# Altium schematic sheet FPGA - Copy.SchDoc
size A3; DocumentNumber: 6; SheetNumber: 6; SheetTotal: 8
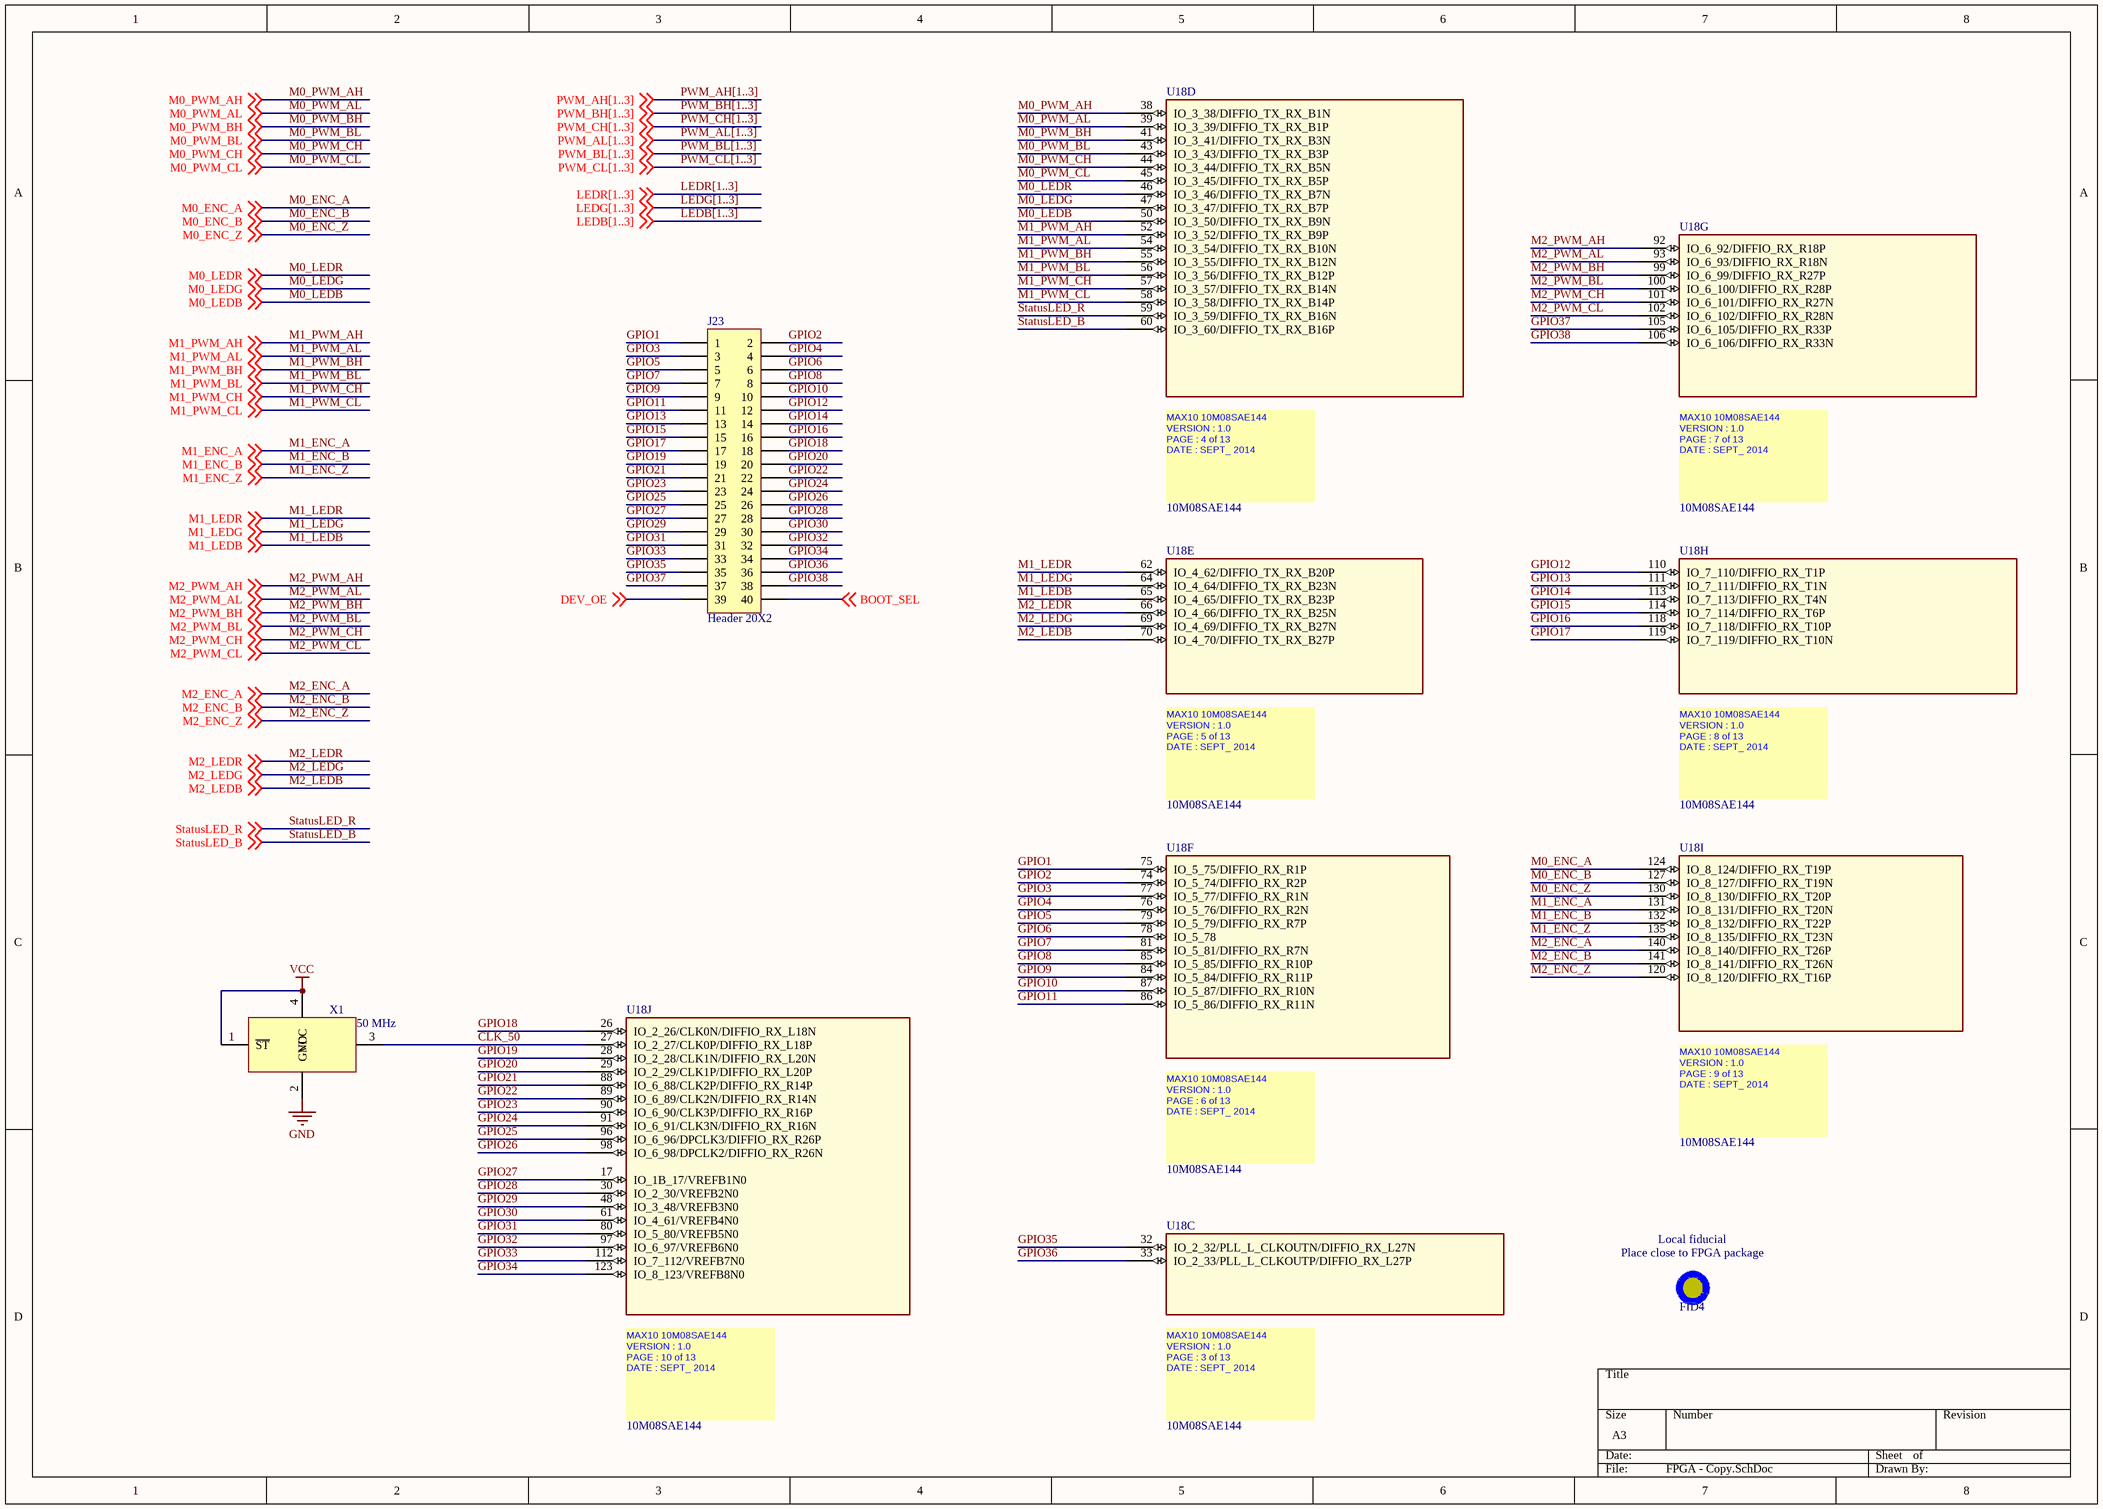
[diagram p0: FPGA - Copy.SchDoc]

## Parts
FID4  FIDUCIAL  [FIDUCIAL]  (value not drawn)
J23  Header 20X2  [HDR2X20]
U18  10M08SAE144  [SQFP50P2200X2200X165_HS-145N]  (parts C,D,E,F,G,H,I,J of 13)
X1  value 50 MHz  [SPXO SG-210STF]  (hidden comment: X1G0041710047)

## Nets
GND: X1.2(GND)
VCC: X1.1(~{ST}) X1.4(VCC)
BOOT_SEL: J23.40 ; off-sheet BOOT_SEL
CLK_50: U18.27(IO_2_27/CLK0P/DIFFIO_RX_L18P) X1.3(CLKout)
DEV_OE: J23.39 ; off-sheet DEV_OE
GPIO1: J23.1 U18.75(IO_5_75/DIFFIO_RX_R1P)
GPIO2: J23.2 U18.74(IO_5_74/DIFFIO_RX_R2P)
GPIO3: J23.3 U18.77(IO_5_77/DIFFIO_RX_R1N)
GPIO4: J23.4 U18.76(IO_5_76/DIFFIO_RX_R2N)
GPIO5: J23.5 U18.79(IO_5_79/DIFFIO_RX_R7P)
GPIO6: J23.6 U18.78(IO_5_78)
GPIO7: J23.7 U18.81(IO_5_81/DIFFIO_RX_R7N)
GPIO8: J23.8 U18.85(IO_5_85/DIFFIO_RX_R10P)
GPIO9: J23.9 U18.84(IO_5_84/DIFFIO_RX_R11P)
GPIO10: J23.10 U18.87(IO_5_87/DIFFIO_RX_R10N)
GPIO11: J23.11 U18.86(IO_5_86/DIFFIO_RX_R11N)
GPIO12: J23.12 U18.110(IO_7_110/DIFFIO_RX_T1P)
GPIO13: J23.13 U18.111(IO_7_111/DIFFIO_RX_T1N)
GPIO14: J23.14 U18.113(IO_7_113/DIFFIO_RX_T4N)
GPIO15: J23.15 U18.114(IO_7_114/DIFFIO_RX_T6P)
GPIO16: J23.16 U18.118(IO_7_118/DIFFIO_RX_T10P)
GPIO17: J23.17 U18.119(IO_7_119/DIFFIO_RX_T10N)
GPIO18: J23.18 U18.26(IO_2_26/CLK0N/DIFFIO_RX_L18N)
GPIO19: J23.19 U18.28(IO_2_28/CLK1N/DIFFIO_RX_L20N)
GPIO20: J23.20 U18.29(IO_2_29/CLK1P/DIFFIO_RX_L20P)
GPIO21: J23.21 U18.88(IO_6_88/CLK2P/DIFFIO_RX_R14P)
GPIO22: J23.22 U18.89(IO_6_89/CLK2N/DIFFIO_RX_R14N)
GPIO23: J23.23 U18.90(IO_6_90/CLK3P/DIFFIO_RX_R16P)
GPIO24: J23.24 U18.91(IO_6_91/CLK3N/DIFFIO_RX_R16N)
GPIO25: J23.25 U18.96(IO_6_96/DPCLK3/DIFFIO_RX_R26P)
GPIO26: J23.26 U18.98(IO_6_98/DPCLK2/DIFFIO_RX_R26N)
GPIO27: J23.27 U18.17(IO_1B_17/VREFB1N0)
GPIO28: J23.28 U18.30(IO_2_30/VREFB2N0)
GPIO29: J23.29 U18.48(IO_3_48/VREFB3N0)
GPIO30: J23.30 U18.61(IO_4_61/VREFB4N0)
GPIO31: J23.31 U18.80(IO_5_80/VREFB5N0)
GPIO32: J23.32 U18.97(IO_6_97/VREFB6N0)
GPIO33: J23.33 U18.112(IO_7_112/VREFB7N0)
GPIO34: J23.34 U18.123(IO_8_123/VREFB8N0)
GPIO35: J23.35 U18.32(IO_2_32/PLL_L_CLKOUTN/DIFFIO_RX_L27N)
GPIO36: J23.36 U18.33(IO_2_33/PLL_L_CLKOUTP/DIFFIO_RX_L27P)
GPIO37: J23.37 U18.105(IO_6_105/DIFFIO_RX_R33P)
GPIO38: J23.38 U18.106(IO_6_106/DIFFIO_RX_R33N)
M0_ENC_A: U18.124(IO_8_124/DIFFIO_RX_T19P) ; off-sheet M0_ENC_A
M0_ENC_B: U18.127(IO_8_127/DIFFIO_RX_T19N) ; off-sheet M0_ENC_B
M0_ENC_Z: U18.130(IO_8_130/DIFFIO_RX_T20P) ; off-sheet M0_ENC_Z
M0_LEDB: U18.50(IO_3_50/DIFFIO_TX_RX_B9N) ; off-sheet M0_LEDB
M0_LEDG: U18.47(IO_3_47/DIFFIO_TX_RX_B7P) ; off-sheet M0_LEDG
M0_LEDR: U18.46(IO_3_46/DIFFIO_TX_RX_B7N) ; off-sheet M0_LEDR
M0_PWM_AH: U18.38(IO_3_38/DIFFIO_TX_RX_B1N) ; off-sheet M0_PWM_AH
M0_PWM_AL: U18.39(IO_3_39/DIFFIO_TX_RX_B1P) ; off-sheet M0_PWM_AL
M0_PWM_BH: U18.41(IO_3_41/DIFFIO_TX_RX_B3N) ; off-sheet M0_PWM_BH
M0_PWM_BL: U18.43(IO_3_43/DIFFIO_TX_RX_B3P) ; off-sheet M0_PWM_BL
M0_PWM_CH: U18.44(IO_3_44/DIFFIO_TX_RX_B5N) ; off-sheet M0_PWM_CH
M0_PWM_CL: U18.45(IO_3_45/DIFFIO_TX_RX_B5P) ; off-sheet M0_PWM_CL
M1_ENC_A: U18.131(IO_8_131/DIFFIO_RX_T20N) ; off-sheet M1_ENC_A
M1_ENC_B: U18.132(IO_8_132/DIFFIO_RX_T22P) ; off-sheet M1_ENC_B
M1_ENC_Z: U18.135(IO_8_135/DIFFIO_RX_T23N) ; off-sheet M1_ENC_Z
M1_LEDB: U18.65(IO_4_65/DIFFIO_TX_RX_B23P) ; off-sheet M1_LEDB
M1_LEDG: U18.64(IO_4_64/DIFFIO_TX_RX_B23N) ; off-sheet M1_LEDG
M1_LEDR: U18.62(IO_4_62/DIFFIO_TX_RX_B20P) ; off-sheet M1_LEDR
M1_PWM_AH: U18.52(IO_3_52/DIFFIO_TX_RX_B9P) ; off-sheet M1_PWM_AH
M1_PWM_AL: U18.54(IO_3_54/DIFFIO_TX_RX_B10N) ; off-sheet M1_PWM_AL
M1_PWM_BH: U18.55(IO_3_55/DIFFIO_TX_RX_B12N) ; off-sheet M1_PWM_BH
M1_PWM_BL: U18.56(IO_3_56/DIFFIO_TX_RX_B12P) ; off-sheet M1_PWM_BL
M1_PWM_CH: U18.57(IO_3_57/DIFFIO_TX_RX_B14N) ; off-sheet M1_PWM_CH
M1_PWM_CL: U18.58(IO_3_58/DIFFIO_TX_RX_B14P) ; off-sheet M1_PWM_CL
M2_ENC_A: U18.140(IO_8_140/DIFFIO_RX_T26P) ; off-sheet M2_ENC_A
M2_ENC_B: U18.141(IO_8_141/DIFFIO_RX_T26N) ; off-sheet M2_ENC_B
M2_ENC_Z: U18.120(IO_8_120/DIFFIO_RX_T16P) ; off-sheet M2_ENC_Z
M2_LEDB: U18.70(IO_4_70/DIFFIO_TX_RX_B27P) ; off-sheet M2_LEDB
M2_LEDG: U18.69(IO_4_69/DIFFIO_TX_RX_B27N) ; off-sheet M2_LEDG
M2_LEDR: U18.66(IO_4_66/DIFFIO_TX_RX_B25N) ; off-sheet M2_LEDR
M2_PWM_AH: U18.92(IO_6_92/DIFFIO_RX_R18P) ; off-sheet M2_PWM_AH
M2_PWM_AL: U18.93(IO_6_93/DIFFIO_RX_R18N) ; off-sheet M2_PWM_AL
M2_PWM_BH: U18.99(IO_6_99/DIFFIO_RX_R27P) ; off-sheet M2_PWM_BH
M2_PWM_BL: U18.100(IO_6_100/DIFFIO_RX_R28P) ; off-sheet M2_PWM_BL
M2_PWM_CH: U18.101(IO_6_101/DIFFIO_RX_R27N) ; off-sheet M2_PWM_CH
M2_PWM_CL: U18.102(IO_6_102/DIFFIO_RX_R28N) ; off-sheet M2_PWM_CL
StatusLED_B: U18.60(IO_3_60/DIFFIO_TX_RX_B16P) ; off-sheet StatusLED_B
StatusLED_R: U18.59(IO_3_59/DIFFIO_TX_RX_B16N) ; off-sheet StatusLED_R

## Buses and harness runs
bus LEDB[1..3]
bus LEDG[1..3]
bus LEDR[1..3]
bus PWM_AH[1..3]
bus PWM_AL[1..3]
bus PWM_BH[1..3]
bus PWM_BL[1..3]
bus PWM_CH[1..3]
bus PWM_CL[1..3]

## Notes on the sheet
- (near FID4) Place close to FPGA package
- (near FID4) Local fiducial
- (in symbol 10M08SAE144, part C) MAX10 10M08SAE144 / VERSION : 1.0 / PAGE : 3 of 13 / DATE : SEPT_ 2014 /
- (in symbol 10M08SAE144, part D) MAX10 10M08SAE144 / VERSION : 1.0 / PAGE : 4 of 13 / DATE : SEPT_ 2014 /
- (in symbol 10M08SAE144, part E) MAX10 10M08SAE144 / VERSION : 1.0 / PAGE : 5 of 13 / DATE : SEPT_ 2014 /
- (in symbol 10M08SAE144, part F) MAX10 10M08SAE144 / VERSION : 1.0 / PAGE : 6 of 13 / DATE : SEPT_ 2014 /
- (in symbol 10M08SAE144, part G) MAX10 10M08SAE144 / VERSION : 1.0 / PAGE : 7 of 13 / DATE : SEPT_ 2014 /
- (in symbol 10M08SAE144, part H) MAX10 10M08SAE144 / VERSION : 1.0 / PAGE : 8 of 13 / DATE : SEPT_ 2014 /
- (in symbol 10M08SAE144, part I) MAX10 10M08SAE144 / VERSION : 1.0 / PAGE : 9 of 13 / DATE : SEPT_ 2014 /
- (in symbol 10M08SAE144, part J) MAX10 10M08SAE144 / VERSION : 1.0 / PAGE : 10 of 13 / DATE : SEPT_ 2014 /

## Library data of the parts
FID4 = FIDUCIAL: 1mm Fiducial with 2mm soldermask, 3mm keepout
J23 = Header 20X2: Header, 20-Pin, Dual row; LatestRevisionDate: 17-Jul-2002; LatestRevisionNote: Re-released for DXP Platform.; Publisher: Altium Limited
U18 = 10M08SAE144: SWAP_INFO: (S1+S2+S3+S4+S5+S6+S7+S8+S9+S10+S11+S12+S13); SPLIT_INST: TRUE
X1 = X1G0041710047: OSCILLATOR, SPXO, SG-210STF, 50 MHZ, SMD; Supplier 1: Farnell; Supplier Part Number 1: 2405741RL; Supplier 2: Farnell; Supplier Part Number 2: 2405741; Supplier 3: Farnell; Supplier Part Number 3: 2428451